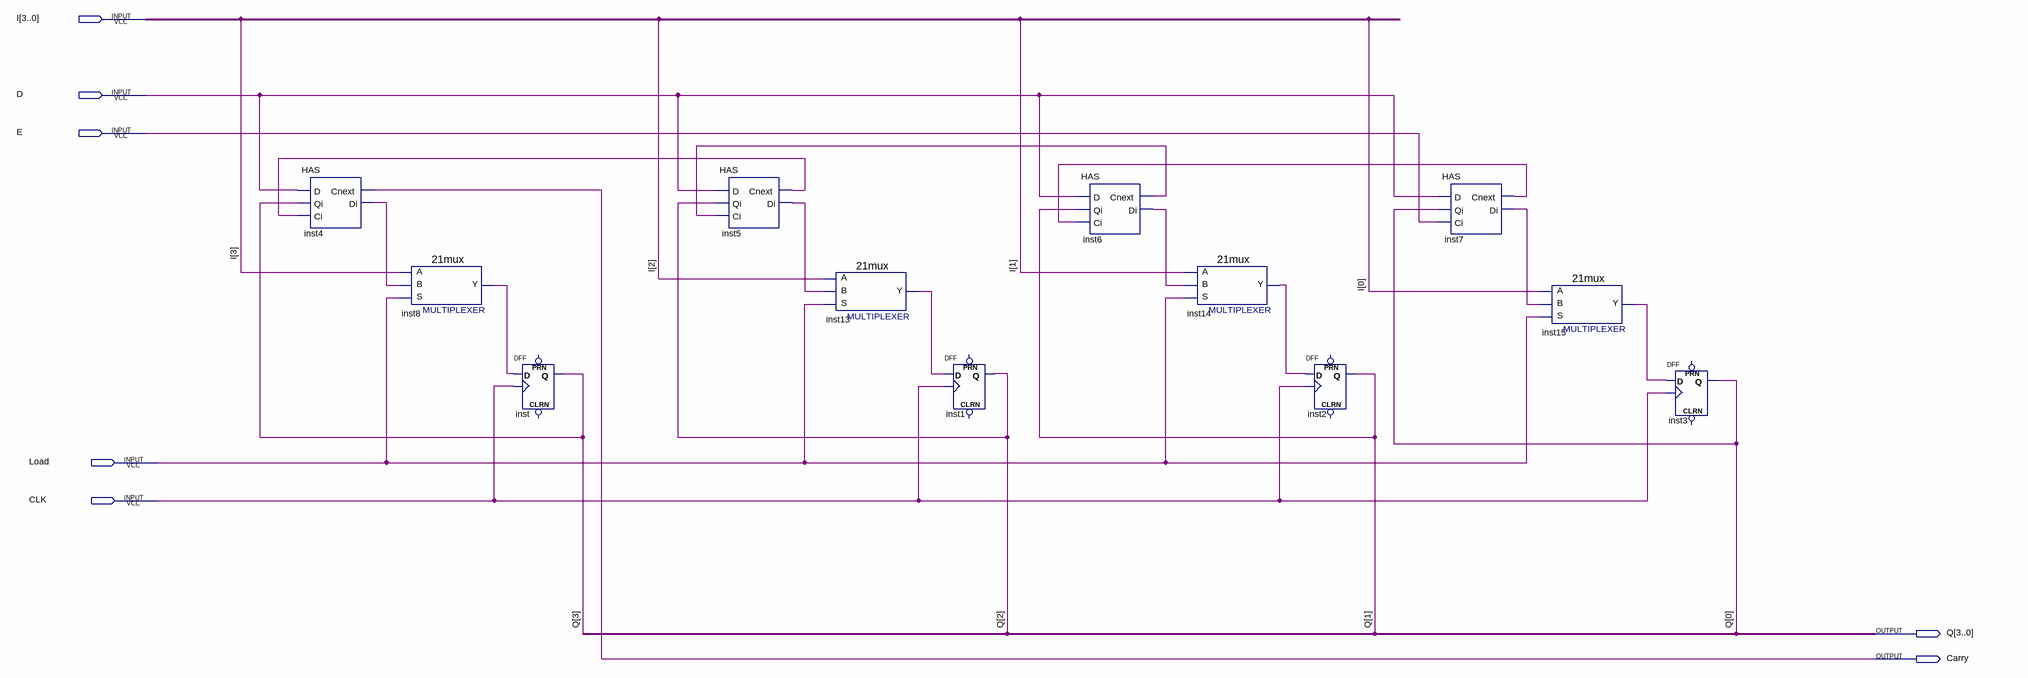
[diagram p0: schematic sheet]
// Quartus schematic counter.bdf as structural Verilog: 12 symbols, 7 pins
module counter (
  input  [3:0] I,
  input  D,
  input  E,
  input  Load,
  input  CLK,
  output [3:0] Q,
  output Carry
);

  wire inst4_di, inst5_cnext, inst5_di, inst6_cnext, inst6_di, inst7_cnext, inst7_di, inst8_y, inst13_y,
       inst14_y, inst15_y;

  HAS inst4 (.D(D), .Qi(Q[3]), .Ci(inst5_cnext), .Cnext(Carry), .Di(inst4_di));
  \21mux  inst8 (.S(Load), .B(inst4_di), .A(I[3]), .Y(inst8_y));
  DFF inst (.CLK(CLK), .D(inst8_y), .Q(Q[3]));  // open: CLRN, PRN
  HAS inst5 (.D(D), .Qi(Q[2]), .Ci(inst6_cnext), .Cnext(inst5_cnext), .Di(inst5_di));
  \21mux  inst13 (.S(Load), .B(inst5_di), .A(I[2]), .Y(inst13_y));
  DFF inst1 (.CLK(CLK), .D(inst13_y), .Q(Q[2]));  // open: CLRN, PRN
  HAS inst6 (.D(D), .Qi(Q[1]), .Ci(inst7_cnext), .Cnext(inst6_cnext), .Di(inst6_di));
  \21mux  inst14 (.S(Load), .B(inst6_di), .A(I[1]), .Y(inst14_y));
  DFF inst2 (.CLK(CLK), .D(inst14_y), .Q(Q[1]));  // open: CLRN, PRN
  HAS inst7 (.D(D), .Qi(Q[0]), .Ci(E), .Cnext(inst7_cnext), .Di(inst7_di));
  \21mux  inst15 (.S(Load), .B(inst7_di), .A(I[0]), .Y(inst15_y));
  DFF inst3 (.CLK(CLK), .D(inst15_y), .Q(Q[0]));  // open: CLRN, PRN
endmodule
